# EAGLE design fonte (EAGLE 9.6.2)
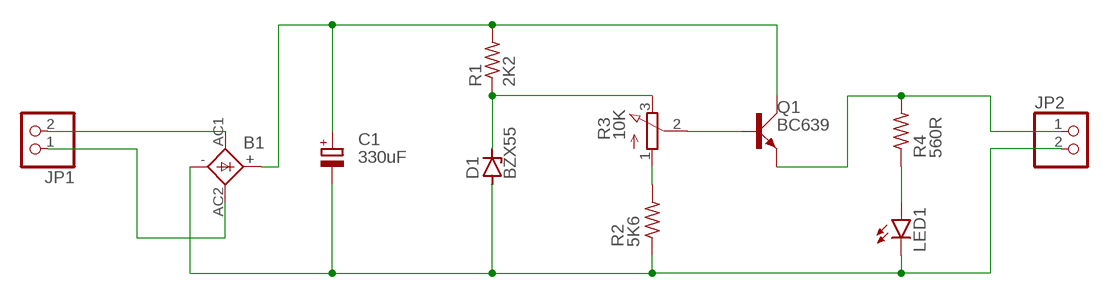
[diagram p0: schematic, sheet 1]

## Parts
B1  1KAB  [1KAB]
C1  330uF  CPOL-EUE3.5-10  [E3,5-10]
D1  BZX55  [DO35Z10]
JP1  PINHD-1X2  [1X02]
JP2  PINHD-1X2  [1X02]
LED1  LED3MM  [LED3MM]
Q1  BC639  [SOT54D]
R1  2K2  R-US_0309/12  [0309/12]
R2  5K6  R-US_0309/12  [0309/12]
R3  10K  3RP/1610N  [3RP/1610N]
R4  560R  R-US_0309/12  [0309/12]

## Nets
N$1: B1.AC1 JP1.2
N$2: B1.AC2 JP1.1
N$3: B1.+ C1.+ Q1.C R1.2
N$4: B1.- C1.- D1.A JP2.2 LED1.K(C) R2.1
N$5: D1.C R1.1 R3.3(E)
N$6: R2.2 R3.1(A)
N$7: Q1.B R3.2(S)
N$8: JP2.1 Q1.E R4.2
N$9: LED1.A R4.1

## Library data of the parts
B1 = rectifier:1KAB: RECTIFIER grid 5,08 x 5,08 mm
C1 = rcl:CPOL-EU: POLARIZED CAPACITOR, European symbol; SPICEPREFIX: C
D1 = diode:BZX55: Z DIODE
JP1 JP2 = pinhead:PINHD-1X2: PIN HEADER
LED1 = led:LED: LED OSRAM: - CHIPLED LG R971, LG N971, LY N971, LG Q971, LY Q971, LO R971, LY R971 LH N974, LH R974 LS Q976, LO Q976, LY Q976 LO Q996 - Hyper CHIPLED LW Q18S LB Q993, LB Q99A, LB R99A - SideLED LS A670, LO A670, LY A670, LG A670, LP A670 LB A673, LV A673, LT A673, LW A673 LH A674 LY A675 LS A676, LA A676, LO A676, LY A676, LW A676 LS A679, LY A679, LG A679 - Hyper Micro SIDELED® LS Y876, LA Y876, LO Y876, LY Y876 LT Y87S - SmartLED LW L88C, LW L88S LB L89C, LB L89S, LG L890 LS L89K, LO L89K, LY L89K LS L896, LA L896, LO L896, LY L896 - TOPLED LS T670, LO T670, LY T670, LG T670, LP T670 LSG T670, LSP T670, LSY T670, LOP T670, LYG T670 LG T671, LOG T671, LSG T671 LB T673, LV T673, LT T673, LW T673 LH T674 LS T676, LA T676, LO T676, LY T676, LB T676, LH T676, LSB T676, LW T676 LB T67C, LV T67C, LT T67C, LS T67K, LO T67K, LY T67K, LW E67C LS E67B, LA E67B, LO E67B, LY E67B, LB E67C, LV E67C, LT E67C LW T67C LS T679, LY T679, LG T679 LS T770, LO T770, LY T770, LG T770, LP T770 LB T773, LV T773, LT T773, LW T773 LH T774 LS E675, LA E675, LY E675, LS T675 LS T776, LA T776, LO T776, LY T776, LB T776 LHGB T686 LT T68C, LB T68C - Hyper Mini TOPLED® LB M676 - Mini TOPLED Santana® LG M470 LS M47K, LO M47K, LY M47K Source: http://www.osram.convergy.de LUXEON: - LUMILED® LXK2-PW12-R00, LXK2-PW12-S00, LXK2-PW14-U00, LXK2-PW14-V00 LXK2-PM12-R00, LXK2-PM12-S00, LXK2-PM14-U00 LXK2-PE12-Q00, LXK2-PE12-R00, LXK2-PE12-S00, LXK2-PE14-T00, LXK2-PE14-U00 LXK2-PB12-K00, LXK2-PB12-L00, LXK2-PB12-M00, LXK2-PB14-N00, LXK2-PB14-P00, LXK2-PB14-Q00 LXK2-PR12-L00, LXK2-PR12-M00, LXK2-PR14-Q00, LXK2-PR14-R00 LXK2-PD12-Q00, LXK2-PD12-R00, LXK2-PD12-S00 LXK2-PH12-R00, LXK2-PH12-S00 LXK2-PL12-P00, LXK2-PL12-Q00, LXK2-PL12-R00 Source: www.luxeon.com KINGBRIGHT: KA-3528ASYC Source: www.kingbright.com
Q1 = transistor-small-signal:BC639: NPN TRANSISTOR
R1 R2 R4 = rcl:R-US_: RESISTOR, American symbol; SPICEPREFIX: R
R3 = pot:3RP/1610N: 16mm Potentiometer one level Source: http://www.alphapotentiometers.net/html/16mm_pot_2.html

## Board
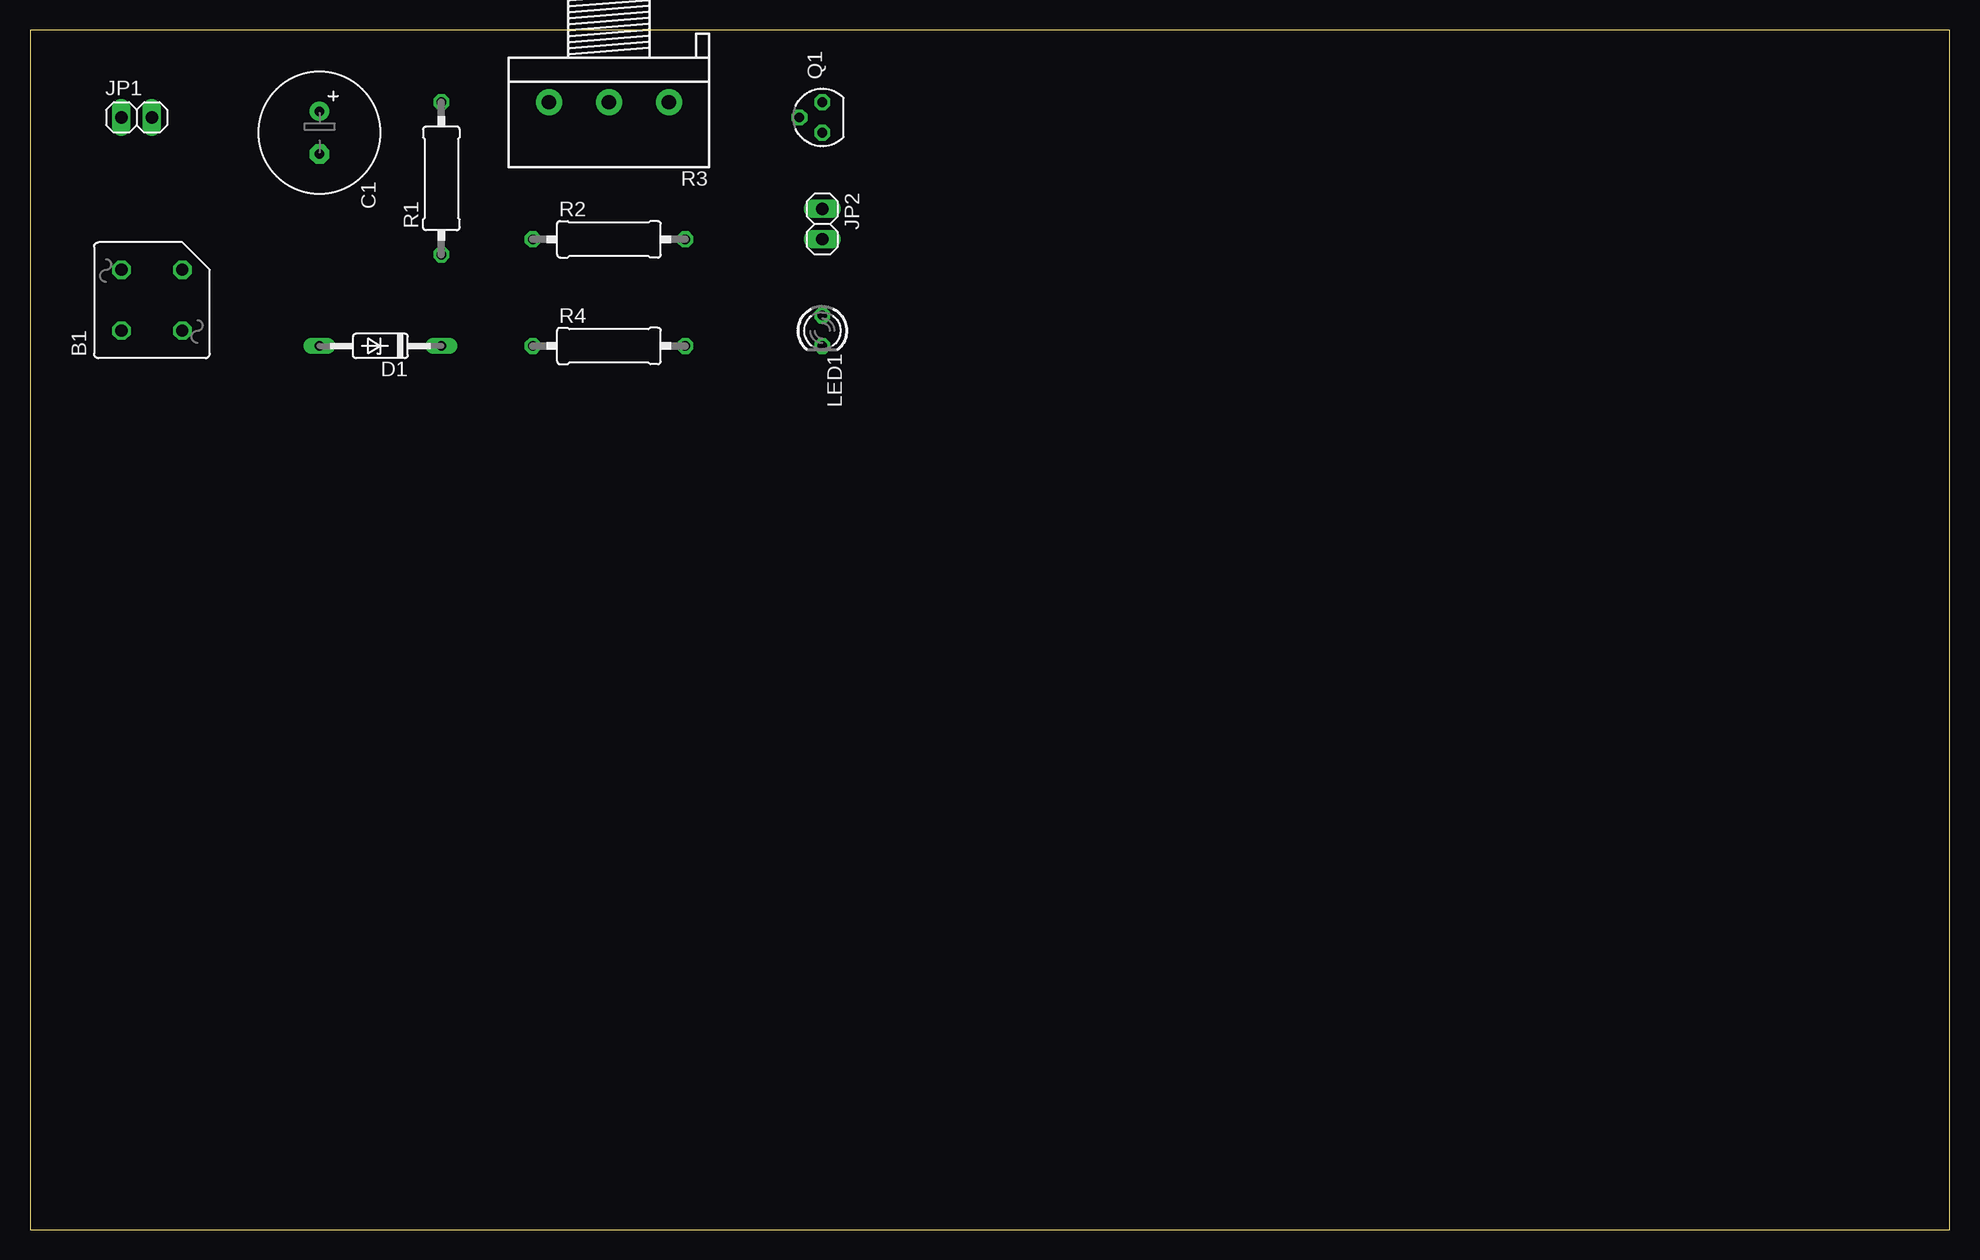
[diagram p1: board, top side]
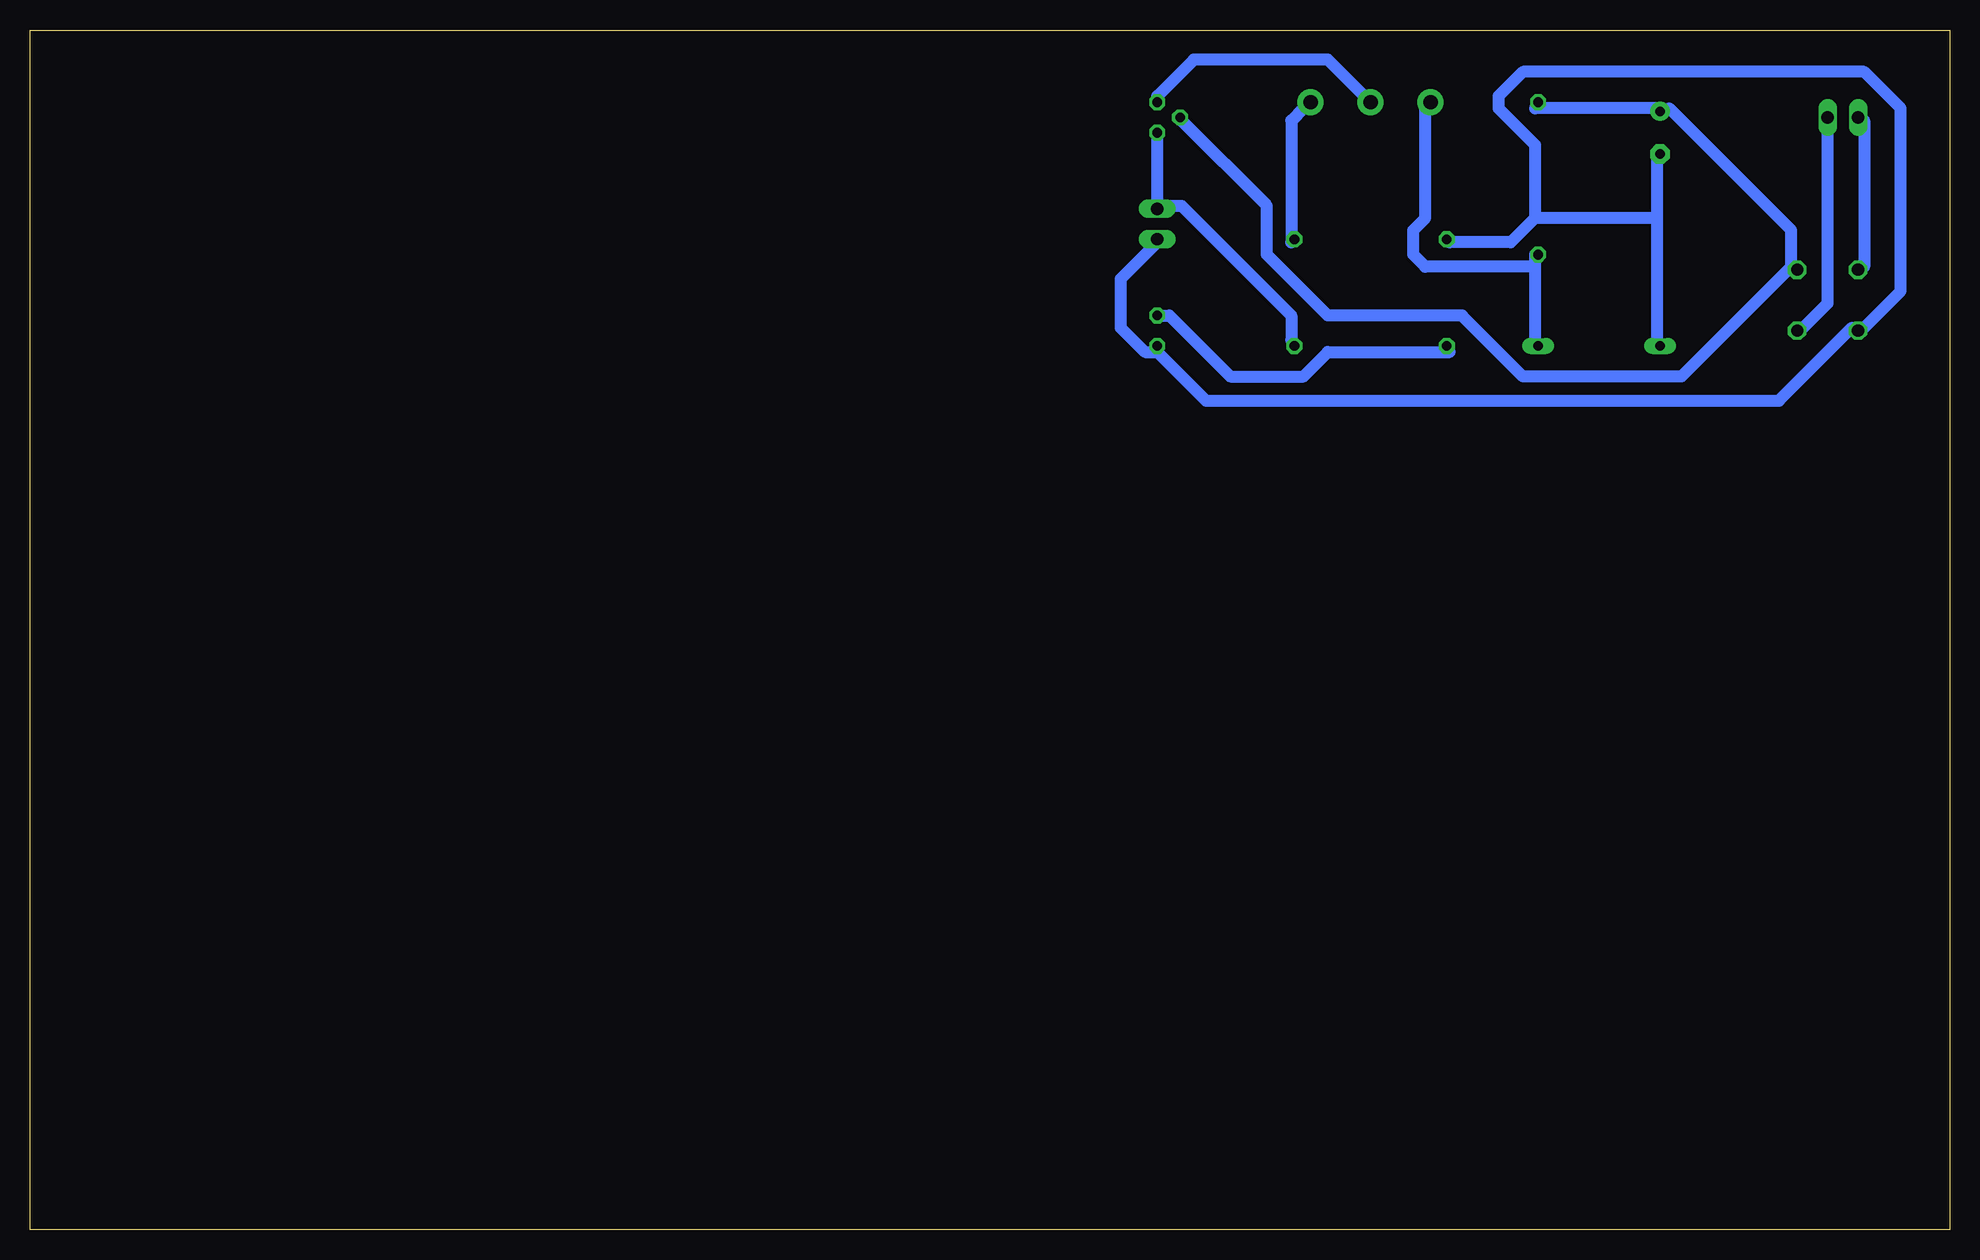
[diagram p2: board, bottom side, seen from below]

Size 160 x 100 mm. Coordinates in mm from the lower left corner, seen from the top.
Outline: 0,0 160,0 160,100 0,100 0,0
Copper layers (1*16): Top 0.035mm / dielectric 1.5mm / Bottom 0.035mm
Design rules "default *": minimum track width 40mil, minimum drill 0.35mm, track to track 40mil, track to pad 40mil, pad to pad 40mil, via to via 40mil, smd to smd 6mil, copper to edge 40mil, drill to drill 6mil, minimum pad ring 10mil, minimum via ring 8mil, stop-mask expansion 4mil, vias tented up to drill 0mil, thermal gap 10mil

### Footprints (pad centres in the part's own frame; a part is rotated, then mirrored left to right if it is on the bottom)
1KAB = drill 1.016 octagon: + 2.54,-2.54; - -2.54,2.54; AC1 -2.54,-2.54; AC2 2.54,2.54
E3,5-10 = drill 0.813 pad 1.6: + -1.778,0 | drill 0.813 pad 1.6 octagon: - 1.778,0
DO35Z10 = drill 0.813 long: A 5.08,0; C -5.08,0
1X02 = drill 1.016 long: 1 -1.27,0; 2 1.27,0
LED3MM = drill 0.813 octagon: A -1.27,0; K 1.27,0
SOT54D = drill 0.813 octagon: B 1.27,0; C 0,1.905; E -1.27,0
0309/12 = drill 0.813 octagon: 1 -6.35,0; 2 6.35,0
3RP/1610N = drill 1.2 pad 2.184: 1 -5,0; 2 0,0; 3 5,0

### Placement (x,y rotation side)
B1  10.16,77.47 90 top
C1  24.13,91.44 270 top
D1  29.21,73.66 180 top
JP1  8.89,92.71 0 top
JP2  66.04,83.82 270 top
LED1  66.04,74.93 270 top
Q1  66.04,92.71 90 top
R1  34.29,87.63 90 top
R2  48.26,82.55 0 top
R3  48.26,93.98 180 top
R4  48.26,73.66 0 top

### Tracks (layer width: path | path; a pad name or v marks a point on that pad's centre or on a via)
N$1
  Bottom 1.016: JP1.2 10.16,77.22 12.19,75.18 B1.AC1
N$2
  Bottom 1.016: B1.AC2 7.11,80.26 7.11,92.46 JP1.1
N$3
  Bottom 1.016: R1.2 34.54,93.47 24.38,93.47 C1.+ 23.37,93.47 13.21,83.31 13.21,80.26 | 13.21,80.26 22.35,71.12 35.56,71.12 40.64,76.2 51.82,76.2 56.9,81.28 56.9,85.34 64.01,92.46 Q1.C | 13.21,80.26 B1.+
N$4
  Bottom 1.016: 24.38,84.33 24.38,89.41 C1.- | 24.38,84.33 24.38,74.17 D1.A | 34.54,84.33 36.58,82.3 41.66,82.3 R2.1 | 24.38,84.33 34.54,84.33 | 66.04,73.15 67.06,73.15 69.09,75.18 69.09,79.25 66.04,82.3 JP2.2 | 66.04,73.15 61.98,69.09 14.22,69.09 8.13,75.18 B1.- 7.11,75.18 4.06,78.23 4.06,93.47 7.11,96.52 35.56,96.52 37.59,94.49 37.59,93.47 34.54,90.42 34.54,84.33 | 66.04,73.15 LED1.K
N$5
  Bottom 1.016: 34.54,80.26 34.54,81.28 R1.1 | 34.54,80.26 34.54,74.17 D1.C | 34.54,80.26 43.69,80.26 44.7,81.28 44.7,83.31 43.69,84.33 43.69,93.47 R3.3
N$6
  Bottom 1.016: R2.2 54.86,82.3 54.86,92.46 53.85,93.47 R3.1
N$7
  Bottom 1.016: R3.2 51.82,97.54 62.99,97.54 66.04,94.49 Q1.B
N$8
  Bottom 1.016: 66.04,85.34 64.01,85.34 54.86,76.2 54.86,74.17 R4.2 | 66.04,85.34 Q1.E | 66.04,85.34 JP2.1
N$9
  Bottom 1.016: LED1.A 65.02,76.2 59.94,71.12 53.85,71.12 51.82,73.15 41.66,73.15 R4.1